# EasyEDA Pro project Type_C硬盘盒_2025-09-27_14-32-02.eprj, schematic Schematic1
Board Name: Board1; Create Date: 2025-09-27; Page Name: P1; Project Name: Type_C硬盘盒_2025-09-27_14-32-02; Schematic Name: Schematic1; Update Date: 2026-01-02; Company: 嘉立创EDA; Drawed: Ideal_Fox; Page Size: A3; Version: V3.0
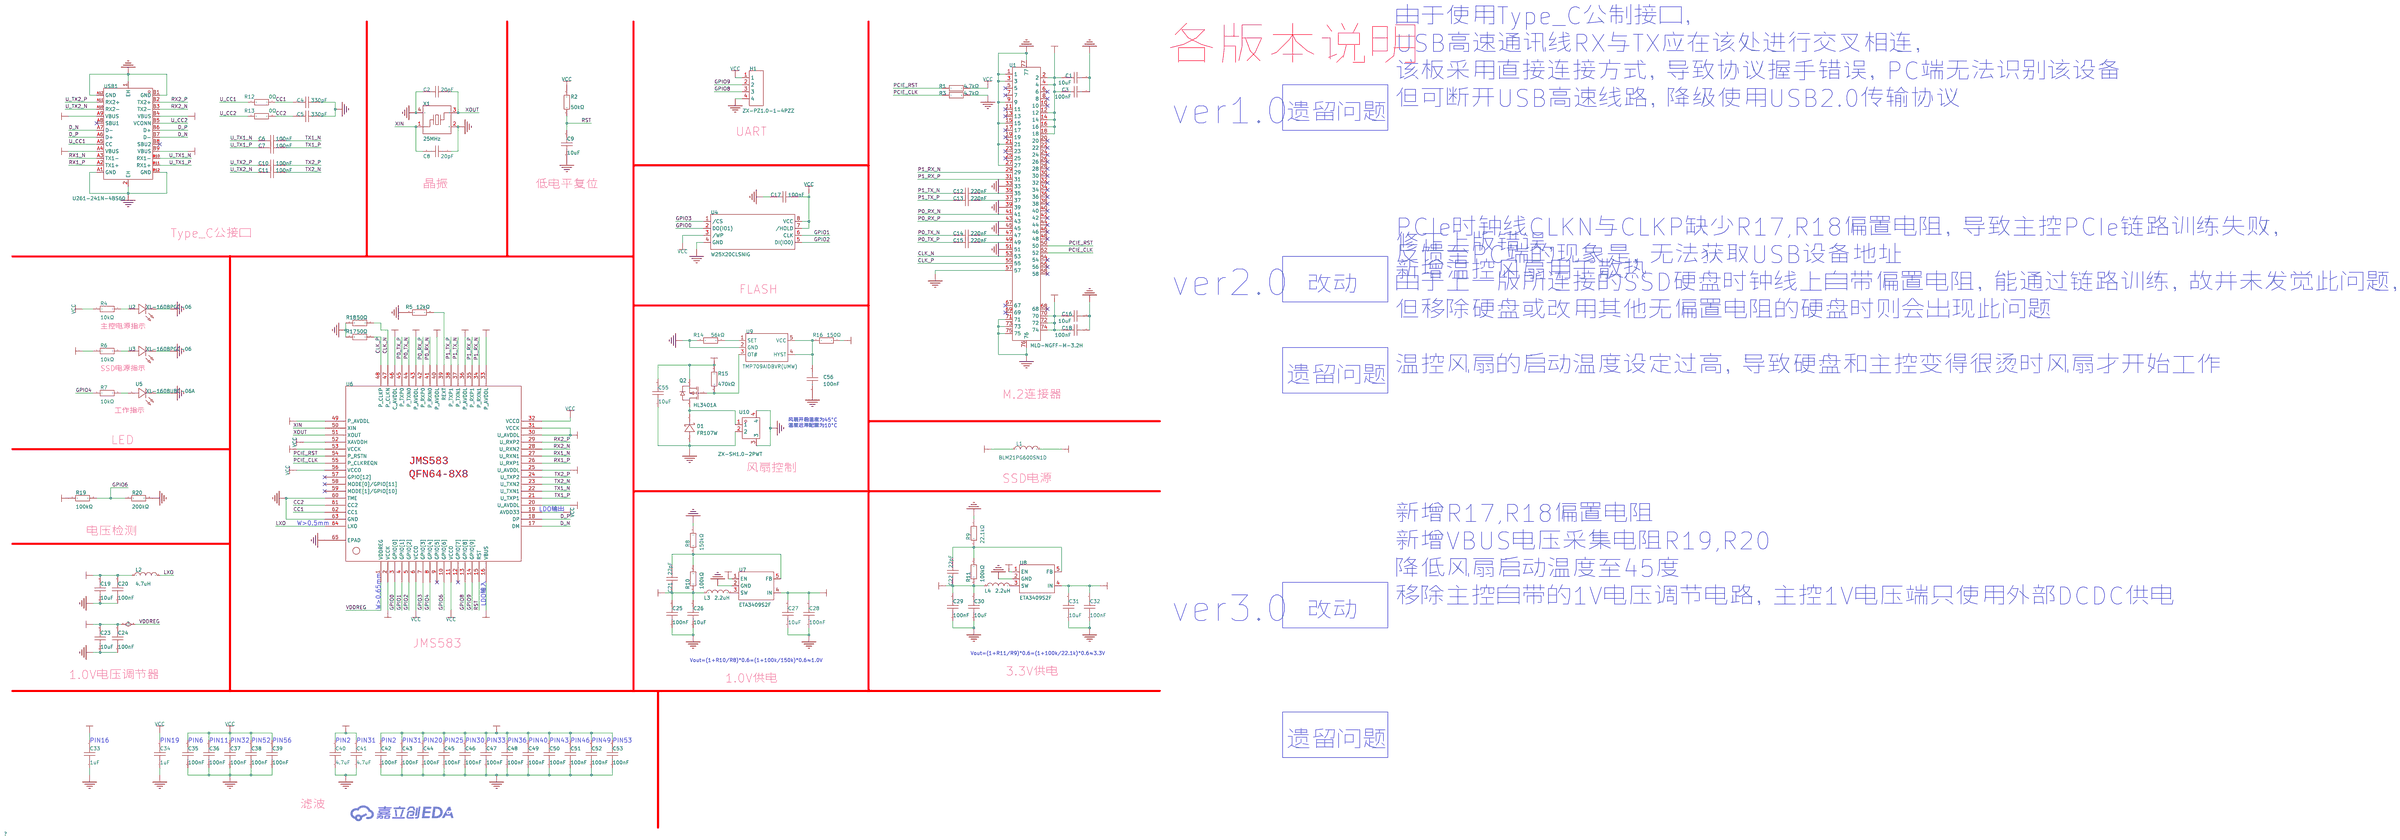
[diagram p0: schematic sheet]

## Parts
C1  10uF  [C0603]
C2  20pF  [C0402]
C3  100nF  [C0402]
C4  330pF  [C0402]
C5  330pF  [C0402]
C6  100nF  [C0402]
C7  100nF  [C0402]
C8  20pF  [C0402]
C9  10uF  [C0603]
C10  100nF  [C0402]
C11  100nF  [C0402]
C12  220nF  [C0402]
C13  220nF  [C0402]
C14  220nF  [C0402]
C15  220nF  [C0402]
C16  10uF  [C0603]
C17  100nF  [C0402]
C18  100nF  [C0402]
C19  10uF  [C0603]
C20  100nF  [C0402]
C21  22pF  [C0402]
C22  22pF  [C0402]
C23  10uF  [C0603]
C24  100nF  [C0402]
C25  100nF  [C0402]
C26  10uF  [C0603]
C27  10uF  [C0603]
C28  100nF  [C0402]
C29  100nF  [C0402]
C30  10uF  [C0603]
C31  10uF  [C0603]
C32  100nF  [C0402]
C33  1uF  [C0603]
C34  1uF  [C0603]
C35  100nF  [C0402]
C36  100nF  [C0402]
C37  100nF  [C0402]
C38  100nF  [C0402]
C39  100nF  [C0402]
C40  4.7uF  [C0603]
C41  4.7uF  [C0603]
C42  100nF  [C0402]
C43  100nF  [C0402]
C44  100nF  [C0402]
C45  100nF  [C0402]
C46  100nF  [C0402]
C47  100nF  [C0402]
C48  100nF  [C0402]
C49  100nF  [C0402]
C50  100nF  [C0402]
C51  100nF  [C0402]
C52  100nF  [C0402]
C53  100nF  [C0402]
C55  10uF  [C0603]
C56  100nF  [C0402]
D1  FR107W  [SOD-123FL_L2.7-W1.8-LS3.8-RD]
H1  ZX-PZ1.0-1-4PZZ  [HDR-TH_ZX-PZ1.0-1-4PZZ]
L1  BLM21PG600SN1D  [L0805]
L2  4.7uH  [IND-SMD_L2.5-W2.0-VLS252012CX-150M]
L3  2.2uH  [IND-SMD_L2.5-W2.0_MHCHL2520]
L4  2.2uH  [IND-SMD_L2.5-W2.0_MHCHL2520]
Q2  HL3401A  [SOT-23-3_L2.9-W1.3-P1.90-LS2.4-BR]
R1  4.7kΩ  [R0402]
R2  50kΩ  [R0402]
R3  4.7kΩ  [R0402]
R4  10kΩ  [R0402]
R5  12kΩ  [R0402]
R6  10kΩ  [R0402]
R7  10kΩ  [R0402]
R8  150kΩ  [R0402]
R9  22.1kΩ  [R0402]
R10  100kΩ  [R0402]
R11  100kΩ  [R0402]
R12  0Ω  [R0402]
R13  0Ω  [R0402]
R14  56kΩ  [R0402]
R15  470kΩ  [R0402]
R16  150Ω  [R0402]
R17  50Ω  [R0402]
R18  50Ω  [R0402]
R19  100kΩ  [R0402]
R20  200kΩ  [R0402]
U1  MLD-NGFF-M-3.2H  [CONN-SMD_MLD-NGFF-M-3.2H]
U2  XL-1608PGC-06  [LED0603-RD_GREEN]
U3  XL-1608PGC-06  [LED0603-RD_GREEN]
U4  W25X20CLSNIG  [SOIC-8_L5.0-W4.0-P1.27-LS6.0-BL]
U5  XL-1608UBC-06A  [LED0603-R-RD]
U6  JMS583  [QFN-64_L8.0-W8.0-P0.40-TL-EP6.0]
U7  ETA3409S2F  [SOT-23-5_L2.9-W1.6-P0.95-LS2.8-BL]
U8  ETA3409S2F  [SOT-23-5_L2.9-W1.6-P0.95-LS2.8-BL]
U9  TMP709AIDBVR(UMW)  [SOT-23-5_L3.0-W1.5-P0.95-LS2.8-BL]
U10  ZX-SH1.0-2PWT  [CONN-SMD_2P-P1.00_HX-1.0-2P-WT]
USB1  U261-241N-4BS60  [USB-TYPE-C-SMD_U261-241N-4BS60]
X1  25MHz  [CRYSTAL-SMD_4P-L3.2-W2.5-BL]

## Library data of the parts
C1 C9 C16 C19 C23 C26 C27 C30 C31 C55 = CL10A106KP8NNNC: LCSC Part Name: 10uF ±10% 10V; Supplier Part: C19702; Manufacturer: SAMSUNG(三星); Supplier Footprint: 0603; JLCPCB Part Class: Basic Part; Datasheet: https://item.szlcsc.com/datasheet/CL10A106KP8NNNC/20411.html; Supplier: LCSC; Tolerance: ±10%; Voltage Rating: 10V; Temperature Coefficient: X5R
C2 C8 = 0402CG200J500NT: LCSC Part Name: 20pF ±5% 50V; Supplier Part: C1554; Manufacturer: FH(风华); Supplier Footprint: 0402; JLCPCB Part Class: Basic Part; Datasheet: https://item.szlcsc.com/datasheet/0402CG200J500NT/1906.html; Supplier: LCSC; Tolerance: ±5%; Voltage Rating: 50V; Temperature Coefficient: C0G
C3 C6 C7 C10 C11 C17 C18 C20 C24 C25 C28 C29 C32 C35-C39 C42-C53 C56 = CL05B104KO5NNNC: LCSC Part Name: 100nF ±10% 16V; Supplier Part: C1525; Manufacturer: SAMSUNG(三星); Supplier Footprint: 0402; JLCPCB Part Class: Basic Part; Datasheet: https://item.szlcsc.com/datasheet/CL05B104KO5NNNC/1877.html; Supplier: LCSC; Tolerance: ±10%; Voltage Rating: 16V; Temperature Coefficient: X7R
C4 C5 = CL05C331JB5NNNC: LCSC Part Name: 330pF ±5% 50V; Supplier Part: C13533; Manufacturer: SAMSUNG(三星); Supplier Footprint: 0402; JLCPCB Part Class: Extended Part; Datasheet: https://item.szlcsc.com/datasheet/CL05C331JB5NNNC/14182.html; Supplier: LCSC; Tolerance: ±5%; Voltage Rating: 50V; Temperature Coefficient: C0G
C12-C15 = CL05B224KO5NNNC: LCSC Part Name: 220nF ±10% 16V; Supplier Part: C16772; Manufacturer: SAMSUNG(三星); Supplier Footprint: 0402; JLCPCB Part Class: Basic Part; Datasheet: https://item.szlcsc.com/datasheet/CL05B224KO5NNNC/17456.html; Supplier: LCSC; Tolerance: ±10%; Voltage Rating: 16V; Temperature Coefficient: X7R
C21 C22 = 0402CG220J500NT: LCSC Part Name: 22pF ±5% 50V; Supplier Part: C1555; Manufacturer: FH(风华); Supplier Footprint: 0402; JLCPCB Part Class: Basic Part; Datasheet: https://item.szlcsc.com/datasheet/0402CG220J500NT/1907.html; Supplier: LCSC; Tolerance: ±5%; Voltage Rating: 50V; Temperature Coefficient: C0G
C33 C34 = CL10A105KB8NNNC: LCSC Part Name: 1uF ±10% 50V; Supplier Part: C15849; Manufacturer: SAMSUNG(三星); Supplier Footprint: 0603; JLCPCB Part Class: Basic Part; Datasheet: https://item.szlcsc.com/datasheet/CL10A105KB8NNNC/16531.html; Supplier: LCSC; Tolerance: ±10%; Voltage Rating: 50V; Temperature Coefficient: X5R
C40 C41 = CL10A475KO8NNNC: LCSC Part Name: 4.7uF ±10% 16V; Supplier Part: C19666; Manufacturer: SAMSUNG(三星); Supplier Footprint: 0603; JLCPCB Part Class: Basic Part; Datasheet: https://item.szlcsc.com/datasheet/CL10A475KO8NNNC/20375.html; Supplier: LCSC; Tolerance: ±10%; Voltage Rating: 16V; Temperature Coefficient: X5R
D1 = FR107W_C18199114: LCSC Part Name: 耐压:1000V 电流:1A 反向恢复时间：500ns; Supplier Part: C18199114; Manufacturer: R+O(宏嘉诚); Supplier Footprint: SOD-123FL; JLCPCB Part Class: 扩展库; Datasheet: https://item.szlcsc.com/datasheet/FR107W/19354346.html; Supplier: LCSC; Diode Configuration: 独立式; Voltage - Forward(Vf@If): 1.3V@1.0A; Voltage - DC Reverse(Vr): 1kV; Current - Rectified: 1A; Reverse Leakage Current (Ir): 2uA@1000V; Reverse Recovery Time (trr): 500ns; Operating Junction Temperature Range: -55℃~+150℃; Non-Repetitive Peak Forward Surge Current: 30A
H1 = ZX-PZ1.0-1-4PZZ: LCSC Part Name: 1x4P 间距:1mm 方针 直插; Supplier Part: C37328854; Manufacturer: Megastar(兆星); Supplier Footprint: 插件,P=1mm; JLCPCB Part Class: 扩展库; Datasheet: https://item.szlcsc.com/datasheet/ZX-PZ1.0-1-4PZZ/39053335.html; Supplier: LCSC; Pin Structure: 1x4P; Pitch: 1mm; Circluar Pins/Square Pins: 方针; Mounting Type: 直插; Number of Rows: 单排; Number of Pins: 4P; Current Rating: 750mA; Length of Mating Pin: 2mm; Insulation Height: 1mm; Length of End Connection Pin: 2mm; Contact Material: 黄铜; Contact Plating: 金; Operating Temperature: -40℃~+105℃; Color: 黑色
L1 = BLM21PG600SN1D: LCSC Part Name: 单路 0805磁珠 阻抗60Ω@100MHz; Supplier Part: C18305; Manufacturer: muRata(村田); Supplier Footprint: 0805; JLCPCB Part Class: 扩展库; Datasheet: https://item.szlcsc.com/datasheet/BLM21PG600SN1D/19000.html; Supplier: LCSC; Impedance @ Frequency: 60Ω@100MHz; Tolerance: ±25%; DC Resistance(DCR): 20mΩ; Current Rating: 3.5A; Number of Circuits: 1
L2 = FTC252010S4R7MBCA: LCSC Part Name: 4.7uH ±20% 2.6A; Supplier Part: C5832360; Manufacturer: cjiang(长江微电); Supplier Footprint: 1008; JLCPCB Part Class: 扩展库; Datasheet: https://item.szlcsc.com/datasheet/FTC252010S4R7MBCA/6763480.html; Supplier: LCSC; Tolerance: ±20%; Current Rating: 2A; Current - Saturation(Isat): 2.6A; DC Resistance(DCR): 160mΩ
L3 L4 = FTC252012S2R2MBCA: LCSC Part Name: 2.2uH ±20% 3.8A; Supplier Part: C5832372; Manufacturer: cjiang(长江微电); Supplier Footprint: 1008; JLCPCB Part Class: 扩展库; Datasheet: https://atta.szlcsc.com/upload/public/pdf/source/20230602/8FFEDA9C0247A92A0D4B67554BFE4091.pdf; Supplier: LCSC; Tolerance: ±20%; Rated Current: 3A; Saturation Current (Isat): 3.8A; DC Resistance (DCR): 55mΩ; Type: 一体成型电感
Q2 = HL3401A: LCSC Part Name: 1个P沟道 耐压:30V 电流:4.2A; Supplier Part: C7420349; Manufacturer: R+O(宏嘉诚); Supplier Footprint: SOT-23; JLCPCB Part Class: 扩展库; Datasheet: https://item.szlcsc.com/datasheet/HL3401A/8397171.html; Supplier: LCSC; Number: 1个P沟道; Drain to Source Voltage: 30V; Current - Continuous Drain(Id): 4.2A; RDS(on): 50mΩ@10V; Pd - Power Dissipation: 350mW; Gate Threshold Voltage (Vgs(th)): 900mV@250uA; Gate Charge(Qg): 22nC@10V; Input Capacitance(Ciss): 954pF; Reverse Transfer Capacitance (Crss@Vds): 77pF; Operating Temperature: -55℃~+150℃; Type: P沟道; Output Capacitance(Coss): 115pF
R1 R3 = 0402WGF4701TCE: LCSC Part Name: 4.7kΩ ±1% 62.5mW 厚膜电阻; Supplier Part: C25900; Manufacturer: UNI-ROYAL(厚声); Supplier Footprint: 0402; JLCPCB Part Class: Basic Part; Datasheet: https://item.szlcsc.com/datasheet/0402WGF4701TCE/26643.html; Supplier: LCSC; Type: 厚膜电阻; Tolerance: ±1%; Power(Watts): 62.5mW; Voltage-Supply(Max): 50V; Temperature Coefficient: ±100ppm/℃; Operating Temperature: -55℃~+155℃
R2 = RTT025002FTH: LCSC Part Name: 厚膜电阻 50kΩ ±1% 62.5mW; Supplier Part: C166559; Manufacturer: RALEC(旺诠); Supplier Footprint: 0402; JLCPCB Part Class: Extended Part; Datasheet: https://atta.szlcsc.com/upload/public/pdf/source/20180928/C303758_52AE496EA05AD4D633595C32F5A0EBAF.pdf; Supplier: LCSC; Type: 厚膜电阻; Tolerance: ±1%; Power(Watts): 62.5mW; Overload Voltage (Max): 50V; Temperature Coefficient: ±100ppm/℃; Operating Temperature Range: -55℃~+155℃
R4 R6 R7 = 0402WGF1002TCE: LCSC Part Name: 10kΩ ±1% 62.5mW 厚膜电阻; Supplier Part: C25744; Manufacturer: UNI-ROYAL(厚声); Supplier Footprint: 0402; JLCPCB Part Class: 基础库; Datasheet: https://item.szlcsc.com/datasheet/0402WGF1002TCE/26487.html; Supplier: LCSC; Type: 厚膜电阻; Tolerance: ±1%; Power(Watts): 62.5mW; Voltage-Supply(Max): 50V; Temperature Coefficient: ±100ppm/℃; Operating Temperature: -55℃~+155℃
R5 = 0402WGF1202TCE: LCSC Part Name: 12kΩ ±1% 62.5mW 厚膜电阻; Supplier Part: C25752; Manufacturer: UNI-ROYAL(厚声); Supplier Footprint: 0402; JLCPCB Part Class: Basic Part; Datasheet: https://item.szlcsc.com/datasheet/0402WGF1202TCE/26495.html; Supplier: LCSC; Type: 厚膜电阻; Tolerance: ±1%; Power(Watts): 62.5mW; Voltage-Supply(Max): 50V; Temperature Coefficient: ±100ppm/℃; Operating Temperature: -55℃~+155℃
R8 = 0402WGF1503TCE: LCSC Part Name: 150kΩ ±1% 62.5mW 厚膜电阻; Supplier Part: C25755; Manufacturer: UNI-ROYAL(厚声); Supplier Footprint: 0402; JLCPCB Part Class: Extended Part; Datasheet: https://atta.szlcsc.com/upload/public/pdf/source/20200306/C422600_1E6D84923E4A46A82E41ADD87F860B5C.pdf; Supplier: LCSC; Type: 厚膜电阻; Tolerance: ±1%; Power(Watts): 62.5mW; Overload Voltage (Max): 50V; Temperature Coefficient: ±100ppm/℃; Operating Temperature Range: -55℃~+155℃
R9 = 0402WGF2212TCE: LCSC Part Name: 22.1kΩ ±1% 62.5mW 厚膜电阻; Supplier Part: C43473; Manufacturer: UNI-ROYAL(厚声); Supplier Footprint: 0402; JLCPCB Part Class: Extended Part; Datasheet: https://item.szlcsc.com/datasheet/0402WGF2212TCE/44464.html; Supplier: LCSC; Type: 厚膜电阻; Tolerance: ±1%; Power(Watts): 62.5mW; Voltage-Supply(Max): 50V; Temperature Coefficient: ±100ppm/℃; Operating Temperature: -55℃~+155℃
R10 R11 R19 = 0402WGF1003TCE: LCSC Part Name: 100kΩ ±1% 62.5mW 厚膜电阻; Supplier Part: C25741; Manufacturer: UNI-ROYAL(厚声); Supplier Footprint: 0402; JLCPCB Part Class: Basic Part; Datasheet: https://item.szlcsc.com/datasheet/0402WGF1003TCE/26484.html; Supplier: LCSC; Type: 厚膜电阻; Tolerance: ±1%; Power(Watts): 62.5mW; Voltage-Supply(Max): 50V; Temperature Coefficient: ±100ppm/℃; Operating Temperature: -55℃~+155℃
R12 R13 = 0402WGF0000TCE: LCSC Part Name: 0Ω ±1% 62.5mW 厚膜电阻; Supplier Part: C17168; Manufacturer: UNI-ROYAL(厚声); Supplier Footprint: 0402; JLCPCB Part Class: Basic Part; Datasheet: https://item.szlcsc.com/datasheet/0402WGF0000TCE/17853.html; Supplier: LCSC; Type: 厚膜电阻; Tolerance: ±1%; Power(Watts): 62.5mW; Voltage-Supply(Max): 50V; Temperature Coefficient: ±800ppm/℃; Operating Temperature: -55℃~+155℃
R14 = 0402WGF5602TCE: LCSC Part Name: 56kΩ ±1% 62.5mW 厚膜电阻; Supplier Part: C25796; Manufacturer: UNI-ROYAL(厚声); Supplier Footprint: 0402; JLCPCB Part Class: Extended Part; Datasheet: https://item.szlcsc.com/datasheet/0402WGF5602TCE/26539.html; Supplier: LCSC; Type: 厚膜电阻; Tolerance: ±1%; Power(Watts): 62.5mW; Voltage-Supply(Max): 50V; Temperature Coefficient: ±100ppm/℃; Operating Temperature: -55℃~+155℃
R15 = 0402WGF4703TCE: LCSC Part Name: 470kΩ ±1% 62.5mW 厚膜电阻; Supplier Part: C25790; Manufacturer: UNI-ROYAL(厚声); Supplier Footprint: 0402; JLCPCB Part Class: Extended Part; Datasheet: https://item.szlcsc.com/datasheet/0402WGF4703TCE/26533.html; Supplier: LCSC; Type: 厚膜电阻; Tolerance: ±1%; Power(Watts): 62.5mW; Voltage-Supply(Max): 50V; Temperature Coefficient: ±100ppm/℃; Operating Temperature: -55℃~+155℃
R16 = 0402WGF1500TCE: LCSC Part Name: 150Ω ±1% 62.5mW 厚膜电阻; Supplier Part: C25082; Manufacturer: UNI-ROYAL(厚声); Supplier Footprint: 0402; JLCPCB Part Class: Extended Part; Datasheet: https://atta.szlcsc.com/upload/public/pdf/source/20200306/C422600_1E6D84923E4A46A82E41ADD87F860B5C.pdf; Supplier: LCSC; Type: 厚膜电阻; Tolerance: ±1%; Power(Watts): 62.5mW; Overload Voltage (Max): 50V; Temperature Coefficient: ±100ppm/℃; Operating Temperature Range: -55℃~+155℃
R17 R18 = RT0402BRE0750RL: LCSC Part Name: 薄膜电阻 50Ω ±0.1% 62.5mW; Supplier Part: C853312; Manufacturer: YAGEO(国巨); Supplier Footprint: 0402; JLCPCB Part Class: Extended Part; Datasheet: https://atta.szlcsc.com/upload/public/pdf/source/20200610/C326738_5639A9F1B6EB6E4AE2197577D3456E7F.pdf; Supplier: LCSC; Type: 薄膜电阻; Tolerance: ±0.1%; Power(Watts): 62.5mW; Temperature Coefficient: ±50ppm/℃; Operating Temperature Range: -55℃~+155℃
R20 = 0402WGF2003TCE: LCSC Part Name: 200kΩ ±1% 62.5mW 厚膜电阻; Supplier Part: C25764; Manufacturer: UNI-ROYAL(厚声); Supplier Footprint: 0402; JLCPCB Part Class: Basic Part; Datasheet: https://item.szlcsc.com/datasheet/0402WGF2003TCE/26507.html; Supplier: LCSC; Type: 厚膜电阻; Tolerance: ±1%; Power(Watts): 62.5mW; Voltage-Supply(Max): 50V; Temperature Coefficient: ±100ppm/℃; Operating Temperature: -55℃~+155℃
U1 = MLD-NGFF-M-3.2H: LCSC Part Name: NGFF M.2 M KEY 3.2H; Supplier Part: C52766481; Manufacturer: Minlenda(敏连达); Supplier Footprint: SMD; JLCPCB Part Class: Extended Part; Datasheet: https://item.szlcsc.com/datasheet/MLD-NGFF-M-3.2H/55672808.html; Supplier: LCSC
U2 U3 = XL-1608PGC-06: 灯头类型:-;发光颜色:翠绿色;正向压降(Vf):2.6V~3V;功率:-;正向电流:-;波长:515nm~530nm;二极管配置:独立二极管;透镜颜色:绿色透镜;色温:-;发光强度:900mcd;发光角度:120°;载带方式:正贴;工作温度:-;; LCSC Part Name: 0603加粉翠绿0.6T贴片式发光二极管; Supplier Part: C7371905; Manufacturer: XINGLIGHT(成兴光); Supplier Footprint: 0603; JLCPCB Part Class: Extended Part; Datasheet: https://item.szlcsc.com/datasheet/XL-1608PGC-06/8342977.html; Supplier: LCSC; Illumination Color: 翠绿色; Voltage - Forward(Vf): 2.6V~3V; Wavelength - Dominant: 515nm~530nm; Peak Wavelength: 525nm; Diode Configuration: 独立二极管; Lens Color: 绿色透镜; Luminous Intensity: 900mcd; Viewing Angle: 120°; Mounting Style: 正贴
U4 = W25X20CLSNIG: LCSC Part Name: 具有4KB扇区和双IO SPI接口的2Mbit 串行SPI闪存; Supplier Part: C409019; Manufacturer: Winbond(华邦); Supplier Footprint: SOIC-8; JLCPCB Part Class: 扩展库; Datasheet: https://item.szlcsc.com/datasheet/W25X20CLSNIG/398848.html; Supplier: LCSC; Interface: SPI; Memory Size: 2Mbit; Clock Frequency: 104MHz; Voltage - Supply: 2.3V~3.6V; Standby Supply Current: 1uA; Program / Erase Cycles: 100000次; Page Programming Time (Tpp): 400us; Block Erase Time(tBE): 120ms@(32KB); Data Retention - TDR (Year): 20年; Operating Temperature: -40℃~+85℃
U5 = XL-1608UBC-06A: Supplier Part: C7371904; Manufacturer: XINGLIGHT(成兴光); Supplier Footprint: 0603; JLCPCB Part Class: Extended Part; Datasheet: https://item.szlcsc.com/datasheet/XL-1608UBC-06A/8342976.html; Supplier: LCSC; Illumination Color: 蓝色; Voltage - Forward(Vf): 2.6V~3V; Forward Current: 5mA; Wavelength - Dominant: 456nm~476nm; Lens Color: 无色透明透镜; Viewing Angle: 130°; Mounting Sytle: 正贴
U6 = JMS583: PCB Footprint: QFN64-8X8-1; Check: false
U7 U8 = ETA3409S2F: LCSC Part Name: 3A 1MHz 同步降压转换器; Supplier Part: C7465553; Manufacturer: ETA(钰泰); Supplier Footprint: SOT23-5; JLCPCB Part Class: 扩展库; Datasheet: https://atta.szlcsc.com/upload/public/pdf/source/20230717/1A18EB96698AD4DC30E5926DF3CDB8A4.pdf; Supplier: LCSC; Function: 降压型; Output Type: 可调; Voltage - Supply: 2.4V~7.3V; Output Current: 3A; Frequency - Switching: 1MHz; Operating Temperature: -40℃~+85℃; Number of Outputs: 1; Topology: 降压式; Switch tube (built-in/external): 内置
U9 = TMP709AIDBVR(UMW): LCSC Part Name: 温度开关; Supplier Part: C22396387; Manufacturer: UMW(友台半导体); Supplier Footprint: SOT-23-5; JLCPCB Part Class: 扩展库; Datasheet: https://item.szlcsc.com/datasheet/TMP709AIDBVR(UMW)/24000858.html; Supplier: LCSC
U10 = ZX-SH1.0-2PWT: LCSC Part Name: 1x2P 间距:1mm 卧贴 系列:SH; Supplier Part: C7430444; Manufacturer: Megastar(兆星); Supplier Footprint: SMD,P=1mm,卧贴; JLCPCB Part Class: 扩展库; Datasheet: https://item.szlcsc.com/datasheet/ZX-SH1.0-2PWT/8430313.html; Supplier: LCSC; Pins Structure: 1x2P; Pitch: 1mm; Mounting Type: 卧贴; Reference Series: SH; Number of Pins: 2P; Number of Rows: 1; Number of PINs Per Row: 2; Current Rating: 1A; Contact Material: 黄铜; Contact Plating: 锡; Operating Temperature: -40℃~+85℃; Voltage Rating: 50V; Plastic Material: LCP; Supplementary Features: 辅助焊脚; Color: 米色; Z-Height of the Board: 3.15mm; X-Length of Bottom Edge on Board (Spacing Line): 4.35mm; Y-Width of Bottom Edge on Board: 4.3mm
USB1 = U261-241N-4BS60: LCSC Part Name: Type-C 公; Supplier Part: C319150; Manufacturer: XKB Connection(中国星坤); Supplier Footprint: SMD; JLCPCB Part Class: 扩展库; Datasheet: https://atta.szlcsc.com/upload/public/pdf/source/20200227/C319150_AD2CD3943CA114D7AAA081193314EFA4.pdf; Supplier: LCSC; Connector Type: Type-C; Gender: 公; Number of Contacts: 24P; Number of Ports: 1; Current Rating - Power (Max): 5A; Contact Material: 高导铜; Contact Plating: 金; Operating Temperature Range: -40℃~+85℃; Soldering Temperature(Max): 260℃
X1 = XL2EL89CSI-111YLC-25M: LCSC Part Name: YSX321SL 25MHZ 4P 3225 20PF ±10PPM -40~85℃ (±20PPM); Supplier Part: C5280577; Manufacturer: YXC(扬兴晶振); Supplier Footprint: SMD3225-4P; JLCPCB Part Class: 扩展库; Datasheet: https://item.szlcsc.com/datasheet/XL2EL89CSI-111YLC-25M/6016759.html; Supplier: LCSC; Type: 贴片晶振; Normal temperature Frequency Tolerance: ±10ppm; Load Capacitance: 20pF; Frequency Stability: ±20ppm; Operating Temperature: -40℃~+85℃

## Nets
3V3: C22.1 C29.2 C30.2 L1.1 L4.1 R11.2
AVDDL: C19.2 C20.2 C21.1 C25.2 C26.2 C40.2 C41.2 C42.2 C43.2 C44.2 C45.2 C46.2 C47.2 C48.2 C49.2 C50.2 C51.2 C52.2 C53.2 L2.1 L3.1 R10.2 U6.2(VCCK) U6.20(U_AVDDL) U6.25(U_AVDDL) U6.30(U_AVDDL) U6.31(VCCK) U6.33(P_AVDDL) U6.36(P_AVDDL) U6.40(P_AVDDL) U6.43(P_AVDDL) U6.46(C_AVDDL) U6.49(P_AVDDL) U6.53(VCCK)
GND: C1.2 C2.1 C3.1 C4.2 C5.2 C8.1 C9.1 C16.2 C17.1 C18.1 C19.1 C20.1 C23.1 C24.1 C25.1 C26.1 C27.1 C28.1 C29.1 C30.1 C31.1 C32.1 C33.1 C34.1 C35.1 C36.1 C37.1 C38.1 C39.1 C40.1 C41.1 C42.1 C43.1 C44.1 C45.1 C46.1 C47.1 C48.1 C49.1 C50.1 C51.1 C52.1 C53.1 C55.1 C56.2 D1.2(A) H1.4 R3.2 R5.2 R8.1 R9.1 R14.1 R17.2 R18.2 R20.2 U1.1 U1.3 U1.9 U1.15 U1.21 U1.27 U1.33 U1.39 U1.45 U1.51 U1.57 U1.71 U1.73 U1.75 U1.76 U1.77 U2.1(K) U3.1(K) U4.4(GND) U5.2(K) U6.60(TME) U6.63(GND) U6.65(EPAD) U7.2(GND) U8.2(GND) U9.2(GND) U10.2 U10.3 U10.4 USB1.1(EH) USB1.2(EH) USB1.A1(GND) USB1.A12(GND) USB1.B1(GND) USB1.B12(GND) X1.2(GND) X1.4(GND)
VBUS: C23.2 C24.2 C27.2 C28.2 C31.2 C32.2 C33.2 C55.2 Q2.2(S) R15.1 R16.1 R19.1 U6.1(VDDREG) U6.16(VBUS) U7.1(EN) U7.4(IN) U8.1(EN) U8.4(IN) USB1.A4(VBUS) USB1.A9(VBUS) USB1.B4(VBUS) USB1.B9(VBUS)
VCC: C17.2 C34.2 C35.2 C36.2 C37.2 C38.2 C39.2 H1.1 R1.2 R2.1 R4.1 U4.3(/WP) U4.7(/HOLD) U4.8(VCC) U6.6(VCCO) U6.11(VCCO) U6.19(AVDD33) U6.32(VCCO) U6.52(XAVDDH) U6.56(VCCO)
CC1: C4.1 R12.2 U6.62(CC1)
CC2: C5.1 R13.2 U6.61(CC2)
CLK_N: R18.1 U1.53 U6.47(P_CLKN)
CLK_P: R17.1 U1.55 U6.48(P_CLKP)
D_N: U6.17(DM) USB1.A7(D-) USB1.B7(D-)
D_P: U6.18(DP) USB1.A6(D+) USB1.B6(D+)
GPIO0: U4.2(DO(IO1)) U6.3(GPIO[0])
GPIO1: U4.6(CLK) U6.4(GPIO[1])
GPIO2: U4.5(DI(IO0)) U6.5(GPIO[2])
GPIO3: U4.1(/CS) U6.7(GPIO[3])
GPIO4: R7.1 U6.8(GPIO[4])
GPIO6: R19.2 R20.1 U6.10(GPIO[6])
GPIO8: H1.3 U6.13(GPIO[8])
GPIO9: H1.2 U6.14(GPIO[9])
LXO: L2.2 U6.64(LXO)
M.2_3V3: C1.1 C3.2 C16.1 C18.2 L1.2 R6.1 U1.2 U1.4 U1.12 U1.14 U1.16 U1.18 U1.70 U1.72 U1.74
P0_RX_N: U1.41 U6.41(P_RXN0)
P0_RX_P: U1.43 U6.42(P_RXP0)
P0_TX_N: C14.1 U6.44(P_TXN0)
P0_TX_P: C15.1 U6.45(P_TXP0)
P1_RX_N: U1.29 U6.34(P_RXN1)
P1_RX_P: U1.31 U6.35(P_RXP1)
P1_TX_N: C12.1 U6.37(P_TXN1)
P1_TX_P: C13.1 U6.38(P_TXP1)
PCIE_CLK: R3.1 U1.52 U6.55(P_CLKREQN)
PCIE_RST: R1.1 U1.50 U6.54(P_RSTN)
RST: C9.2 R2.2 U6.15(RST)
RX1_N: U6.27(U_RXN1) USB1.A3(TX1-)
RX1_P: U6.26(U_RXP1) USB1.A2(TX1+)
RX2_N: U6.28(U_RXN2) USB1.B3(TX2-)
RX2_P: U6.29(U_RXP2) USB1.B2(TX2+)
TX1_N: C6.2 U6.22(U_TXN1)
TX1_P: C7.2 U6.21(U_TXP1)
TX2_N: C11.2 U6.23(U_TXN2)
TX2_P: C10.2 U6.24(U_TXP2)
U_CC1: R12.1 USB1.A5(CC)
U_CC2: R13.1 USB1.B5(VCONN)
U_TX1_N: C6.1 USB1.B10(RX1-)
U_TX1_P: C7.1 USB1.B11(RX1+)
U_TX2_N: C11.1 USB1.A10(RX2-)
U_TX2_P: C10.1 USB1.A11(RX2+)
XIN: C8.2 U6.50(XIN) X1.1
XOUT: C2.2 U6.51(XOUT) X1.3
$1N2416: C13.2 U1.37
$1N2418: C12.2 U1.35
$1N2496: C15.2 U1.49
$1N2498: C14.2 U1.47
$1N3363: R6.2 U3.2(A)
$1N3561: R7.2 U5.1(A)
$1N4495: R5.1 U6.39(REXT)
$1N10279: C22.2 R9.2 R11.1 U8.5(FB)
$1N10317: L4.2 U8.3(SW)
$1N10953: R4.2 U2.2(A)
$1N11538: L3.2 U7.3(SW)
$1N11540: C21.2 R8.2 R10.1 U7.5(FB)
$1N22897: R14.2 U9.1(SET)
$1N22946: C56.1 R16.2 U9.4(HYST) U9.5(VCC)
$1N23051: Q2.1(G) R15.2 U9.3(OT#)
$1N23334: D1.1(K) Q2.3(D) U10.1

Not connected (* = marked no-connect by the designer): U1 5* 6* 7* 8* 10* 11* 13* 17* 19* 20* 22* 23* 24* 25* 26* 28* 30* 32* 34* 36* 38* 40* 42* 44* 46* 48* 54* 56* 58* 67* 68* 69*; U6 9(GPIO[5])* 12(GPIO[7])* 57(GPIO[12])* 58(MODE[0]/GPIO[11])* 59(MODE[1]/GPIO[10])*; USB1 A8(SBU1)* B8(SBU2)*

## Notes on the sheet
- 各版本说明
- 由于使用Type_C公制接口，
  USB高速通讯线RX与TX应在该处进行交叉相连，
  该板采用直接连接方式，导致协议握手错误，PC端无法识别该设备
  但可断开USB高速线路，降级使用USB2.0传输协议
- 遗留问题
- ver1.0
- UART
- 晶振
- 低电平复位
- Type_C公接口
- 修正上版错误，
  新增温控风扇用于散热
- FLASH
- 改动
- ver2.0
- 主控电源指示
- SSD电源指示
- PCIe时钟线CLKN与CLKP缺少R17,R18偏置电阻，导致主控PCIe链路训练失败，
  反馈至PC端的现象是，无法获取USB设备地址
  由于上一版所连接的SSD硬盘时钟线上自带偏置电阻，能通过链路训练，故并未发觉此问题，
  但移除硬盘或改用其他无偏置电阻的硬盘时则会出现此问题
  温控风扇的启动温度设定过高，导致硬盘和主控变得很烫时风扇才开始工作
- 遗留问题
- M.2连接器
- 工作指示
- 风扇开启温度为45°C
  温度迟滞配置为10°C
- LED
- 风扇控制
- SSD电源
- LDO输出
- W>0.5mm
- 电压检测
- W>0.65mm
- LDO输入
- 新增R17,R18偏置电阻
  新增VBUS电压采集电阻R19,R20
  降低风扇启动温度至45度
  移除主控自带的1V电压调节电路，主控1V电压端只使用外部DCDC供电
- ver3.0
- 改动
- JMS583
- Vout=(1+R11/R9)*0.6=(1+100k/22.1k)*0.6≈3.3V
- Vout=(1+R10/R8)*0.6=(1+100k/150k)*0.6≈1.0V
- 3.3V供电
- 1.0V电压调节器
- 1.0V供电
- PIN16
- PIN19
- PIN6
- PIN11
- PIN32
- PIN52
- PIN56
- PIN2
- PIN31
- PIN2
- PIN31
- PIN20
- PIN25
- PIN30
- PIN33
- PIN36
- PIN40
- PIN43
- PIN46
- PIN49
- PIN53
- 遗留问题
- 滤波
